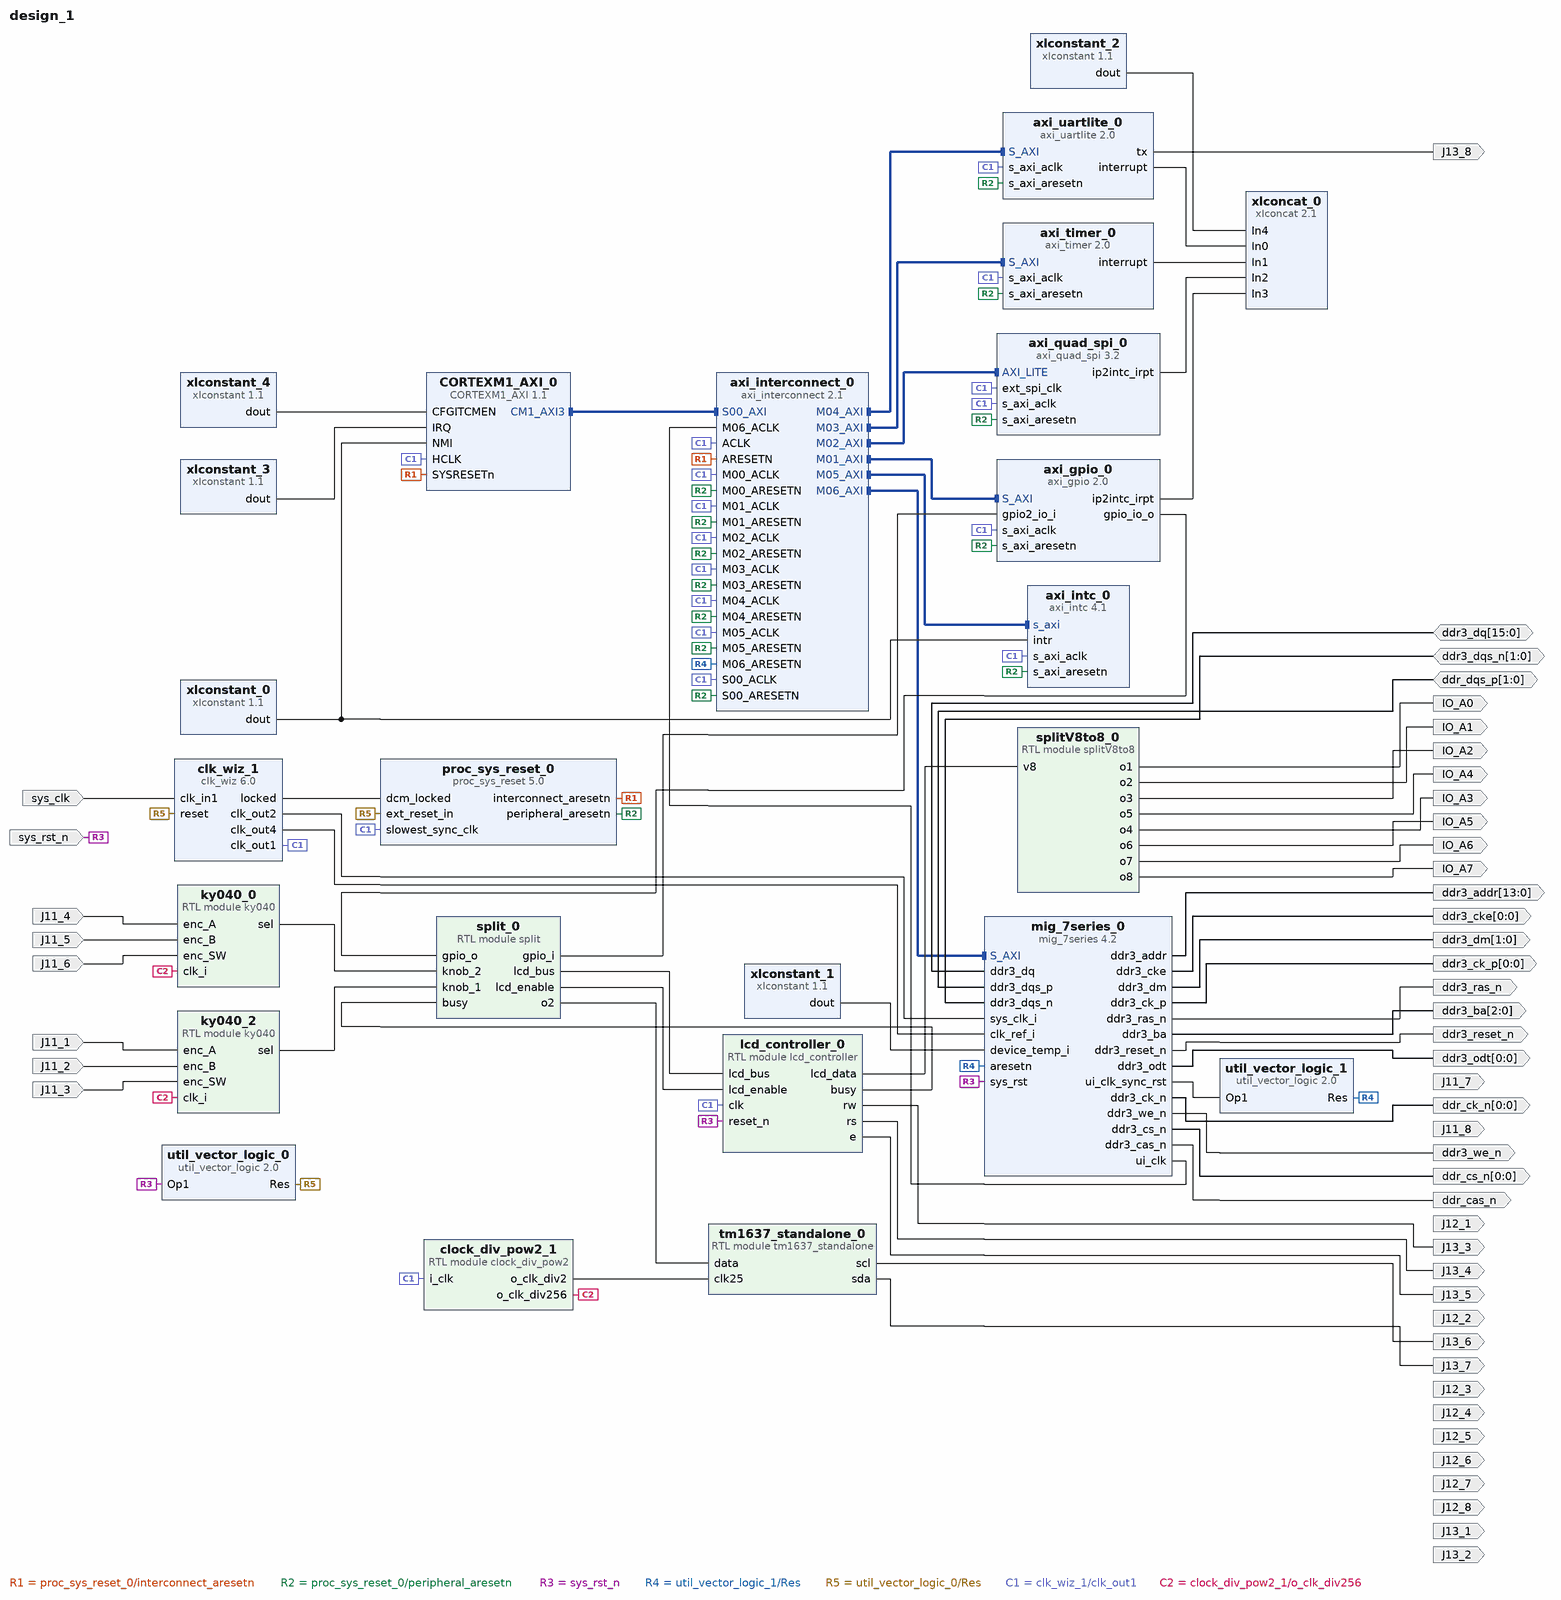
[diagram p0: block diagram of the top level]
# Vivado block design design_1, xc7k325tffg676-1, Vivado 2019.1
create_bd_design design_1

create_bd_port -dir I J11_1
create_bd_port -dir I J11_2
create_bd_port -dir I J11_3
create_bd_port -dir I J11_4
create_bd_port -dir I J11_5
create_bd_port -dir I J11_6
create_bd_port -dir O J11_7
create_bd_port -dir O J11_8
create_bd_port -dir O J12_1
create_bd_port -dir O J12_2
create_bd_port -dir O J12_3
create_bd_port -dir O J12_4
create_bd_port -dir O J12_5
create_bd_port -dir O J12_6
create_bd_port -dir O J12_7
create_bd_port -dir O J12_8
create_bd_port -dir O J13_1
create_bd_port -dir O J13_2
create_bd_port -dir O J13_3
create_bd_port -dir O J13_4
create_bd_port -dir O J13_5
create_bd_port -dir O J13_6
create_bd_port -dir O J13_7
create_bd_port -dir O J13_8
create_bd_port -dir O IO_A0
create_bd_port -dir O IO_A1
create_bd_port -dir O IO_A3
create_bd_port -dir O IO_A4
create_bd_port -dir O IO_A5
create_bd_port -dir O IO_A6
create_bd_port -dir O IO_A7
create_bd_port -dir O IO_A2
create_bd_port -dir I sys_clk
create_bd_port -dir I sys_rst_n
create_bd_port -dir O -from 13 -to 0 ddr3_addr
create_bd_port -dir IO -from 15 -to 0 ddr3_dq
create_bd_port -dir IO -from 1 -to 0 ddr_dqs_p
create_bd_port -dir IO -from 1 -to 0 ddr3_dqs_n
create_bd_port -dir O ddr3_ras_n
create_bd_port -dir O ddr3_we_n
create_bd_port -dir O ddr3_reset_n
create_bd_port -dir O -from 0 -to 0 ddr3_cke
create_bd_port -dir O -from 0 -to 0 ddr3_ck_p
create_bd_port -dir O -from 0 -to 0 ddr_ck_n
create_bd_port -dir O -from 1 -to 0 ddr3_dm
create_bd_port -dir O -from 0 -to 0 ddr_cs_n
create_bd_port -dir O -from 0 -to 0 ddr3_odt
create_bd_port -dir O ddr_cas_n
create_bd_port -dir O -from 2 -to 0 ddr3_ba

create_bd_cell -type ip -vlnv xilinx.com:ip:axi_quad_spi:3.2 axi_quad_spi_0
create_bd_cell -type ip -vlnv xilinx.com:ip:axi_timer:2.0 axi_timer_0
create_bd_cell -type ip -vlnv xilinx.com:ip:axi_uartlite:2.0 axi_uartlite_0
create_bd_cell -type ip -vlnv xilinx.com:ip:axi_gpio:2.0 axi_gpio_0
set_property -dict [list \
  CONFIG.C_ALL_INPUTS_2 1 \
  CONFIG.C_ALL_OUTPUTS 1 \
  CONFIG.C_INTERRUPT_PRESENT 1 \
  CONFIG.C_IS_DUAL 1 \
] [get_bd_cells axi_gpio_0]
create_bd_cell -type ip -vlnv xilinx.com:ip:axi_intc:4.1 axi_intc_0
create_bd_cell -type ip -vlnv xilinx.com:ip:axi_interconnect:2.1 axi_interconnect_0
set_property -dict {CONFIG.NUM_MI 7} [get_bd_cells axi_interconnect_0]
create_bd_cell -type ip -vlnv xilinx.com:ip:proc_sys_reset:5.0 proc_sys_reset_0
set_property -dict {CONFIG.C_AUX_RESET_HIGH 0} [get_bd_cells proc_sys_reset_0]
create_bd_cell -type ip -vlnv xilinx.com:ip:xlconstant:1.1 xlconstant_1
set_property -dict {CONFIG.CONST_VAL 0 CONFIG.CONST_WIDTH 12} [get_bd_cells xlconstant_1]
create_bd_cell -type ip -vlnv xilinx.com:ip:util_vector_logic:2.0 util_vector_logic_0
set_property -dict {CONFIG.C_OPERATION not} [get_bd_cells util_vector_logic_0]
create_bd_cell -type ip -vlnv xilinx.com:ip:xlconstant:1.1 xlconstant_2
set_property -dict {CONFIG.CONST_VAL 0 CONFIG.CONST_WIDTH 4} [get_bd_cells xlconstant_2]
create_bd_cell -type ip -vlnv xilinx.com:ip:xlconstant:1.1 xlconstant_3
set_property -dict {CONFIG.CONST_VAL 0 CONFIG.CONST_WIDTH 4} [get_bd_cells xlconstant_3]
create_bd_cell -type ip -vlnv xilinx.com:ip:xlconstant:1.1 xlconstant_4
set_property -dict {CONFIG.CONST_VAL 3 CONFIG.CONST_WIDTH 2} [get_bd_cells xlconstant_4]
create_bd_cell -type ip -vlnv xilinx.com:ip:xlconcat:2.1 xlconcat_0
set_property -dict {CONFIG.IN4_WIDTH 4 CONFIG.NUM_PORTS 5} [get_bd_cells xlconcat_0]
create_bd_cell -type ip -vlnv xilinx.com:ip:xlconstant:1.1 xlconstant_0
set_property -dict {CONFIG.CONST_VAL 0} [get_bd_cells xlconstant_0]
create_bd_cell -type ip -vlnv xilinx.com:ip:util_vector_logic:2.0 util_vector_logic_1
set_property -dict {CONFIG.C_OPERATION not CONFIG.C_SIZE 1} [get_bd_cells util_vector_logic_1]
create_bd_cell -type module -reference clock_div_pow2 clock_div_pow2_1
create_bd_cell -type ip -vlnv xilinx.com:ip:clk_wiz:6.0 clk_wiz_1
set_property -dict [list \
  CONFIG.CLKIN1_JITTER_PS 200.0 \
  CONFIG.CLKOUT1_JITTER 249.313 \
  CONFIG.CLKOUT1_PHASE_ERROR 155.997 \
  CONFIG.CLKOUT1_REQUESTED_OUT_FREQ 50.000 \
  CONFIG.CLKOUT2_JITTER 153.550 \
  CONFIG.CLKOUT2_PHASE_ERROR 155.997 \
  CONFIG.CLKOUT2_REQUESTED_OUT_FREQ 600.000 \
  CONFIG.CLKOUT2_USED true \
  CONFIG.CLKOUT3_JITTER 173.176 \
  CONFIG.CLKOUT3_PHASE_ERROR 155.997 \
  CONFIG.CLKOUT3_REQUESTED_OUT_FREQ 300.000 \
  CONFIG.CLKOUT3_USED true \
  CONFIG.CLKOUT4_JITTER 185.991 \
  CONFIG.CLKOUT4_PHASE_ERROR 155.997 \
  CONFIG.CLKOUT4_REQUESTED_OUT_FREQ 200.000 \
  CONFIG.CLKOUT4_USED true \
  CONFIG.CLKOUT5_JITTER 185.991 \
  CONFIG.CLKOUT5_PHASE_ERROR 155.997 \
  CONFIG.CLKOUT5_REQUESTED_OUT_FREQ 200.000 \
  CONFIG.CLKOUT5_USED true \
  CONFIG.MMCM_CLKFBOUT_MULT_F 12.000 \
  CONFIG.MMCM_CLKIN1_PERIOD 20.0 \
  CONFIG.MMCM_CLKIN2_PERIOD 10.0 \
  CONFIG.MMCM_CLKOUT0_DIVIDE_F 12.000 \
  CONFIG.MMCM_CLKOUT1_DIVIDE 1 \
  CONFIG.MMCM_CLKOUT2_DIVIDE 2 \
  CONFIG.MMCM_CLKOUT3_DIVIDE 3 \
  CONFIG.MMCM_CLKOUT4_DIVIDE 3 \
  CONFIG.NUM_OUT_CLKS 5 \
  CONFIG.PRIM_IN_FREQ 50.000 \
] [get_bd_cells clk_wiz_1]
create_bd_cell -type module -reference splitV8to8 splitV8to8_0
create_bd_cell -type module -reference split split_0
create_bd_cell -type module -reference tm1637_standalone tm1637_standalone_0
create_bd_cell -type module -reference lcd_controller lcd_controller_0
create_bd_cell -type ip -vlnv xilinx.com:ip:mig_7series:4.2 mig_7series_0
set_property -dict [list \
  CONFIG.BOARD_MIG_PARAM Custom \
  CONFIG.MIG_DONT_TOUCH_PARAM Custom \
  CONFIG.RESET_BOARD_INTERFACE Custom \
  CONFIG.XML_INPUT_FILE mig_a.prj \
] [get_bd_cells mig_7series_0]
create_bd_cell -type ip -vlnv arm.com:CortexM:CORTEXM1_AXI:1.1 CORTEXM1_AXI_0
set_property -dict {CONFIG.DEBUG_SEL 3} [get_bd_cells CORTEXM1_AXI_0]
create_bd_cell -type module -reference ky040 ky040_0
create_bd_cell -type module -reference ky040 ky040_2

# ---- connections ----

connect_bd_intf_net [get_bd_intf_pins axi_interconnect_0/M02_AXI] [get_bd_intf_pins axi_quad_spi_0/AXI_LITE]
connect_bd_intf_net [get_bd_intf_pins axi_interconnect_0/M01_AXI] [get_bd_intf_pins axi_gpio_0/S_AXI]
connect_bd_intf_net [get_bd_intf_pins CORTEXM1_AXI_0/CM1_AXI3] [get_bd_intf_pins axi_interconnect_0/S00_AXI]
connect_bd_intf_net [get_bd_intf_pins axi_interconnect_0/M03_AXI] [get_bd_intf_pins axi_timer_0/S_AXI]
connect_bd_intf_net [get_bd_intf_pins axi_interconnect_0/M04_AXI] [get_bd_intf_pins axi_uartlite_0/S_AXI]
connect_bd_intf_net [get_bd_intf_pins mig_7series_0/S_AXI] [get_bd_intf_pins axi_interconnect_0/M06_AXI]
connect_bd_intf_net [get_bd_intf_pins axi_interconnect_0/M05_AXI] [get_bd_intf_pins axi_intc_0/s_axi]
connect_bd_net [get_bd_pins axi_uartlite_0/tx] [get_bd_ports J13_8]
connect_bd_net [get_bd_pins axi_uartlite_0/interrupt] [get_bd_pins xlconcat_0/In0]
connect_bd_net [get_bd_pins axi_timer_0/interrupt] [get_bd_pins xlconcat_0/In1]
connect_bd_net [get_bd_pins axi_quad_spi_0/ip2intc_irpt] [get_bd_pins xlconcat_0/In2]
connect_bd_net [get_bd_pins axi_gpio_0/gpio_io_o] [get_bd_pins split_0/gpio_o]
connect_bd_net [get_bd_pins splitV8to8_0/o1] [get_bd_ports IO_A0]
connect_bd_net [get_bd_pins splitV8to8_0/o5] [get_bd_ports IO_A4]
connect_bd_net [get_bd_pins splitV8to8_0/o2] [get_bd_ports IO_A1]
connect_bd_net [get_bd_pins splitV8to8_0/o3] [get_bd_ports IO_A2]
connect_bd_net [get_bd_pins splitV8to8_0/o4] [get_bd_ports IO_A3]
connect_bd_net [get_bd_pins splitV8to8_0/o8] [get_bd_ports IO_A7]
connect_bd_net [get_bd_pins splitV8to8_0/o7] [get_bd_ports IO_A6]
connect_bd_net [get_bd_pins splitV8to8_0/o6] [get_bd_ports IO_A5]
connect_bd_net -net J11_1_1 [get_bd_ports J11_1] [get_bd_pins ky040_2/enc_A]
connect_bd_net -net J11_2_1 [get_bd_ports J11_2] [get_bd_pins ky040_2/enc_B]
connect_bd_net -net J11_3_1 [get_bd_ports J11_3] [get_bd_pins ky040_2/enc_SW]
connect_bd_net -net J11_4_1 [get_bd_ports J11_4] [get_bd_pins ky040_0/enc_A]
connect_bd_net -net J11_5_1 [get_bd_ports J11_5] [get_bd_pins ky040_0/enc_B]
connect_bd_net -net J11_6_1 [get_bd_ports J11_6] [get_bd_pins ky040_0/enc_SW]
connect_bd_net [get_bd_pins split_0/gpio_i] [get_bd_pins axi_gpio_0/gpio2_io_i]
connect_bd_net [get_bd_pins axi_gpio_0/ip2intc_irpt] [get_bd_pins xlconcat_0/In3]
connect_bd_net [get_bd_pins tm1637_standalone_0/scl] [get_bd_ports J13_6]
connect_bd_net [get_bd_pins tm1637_standalone_0/sda] [get_bd_ports J13_7]
connect_bd_net [get_bd_pins lcd_controller_0/e] [get_bd_ports J13_5]
connect_bd_net [get_bd_pins lcd_controller_0/rs] [get_bd_ports J13_4]
connect_bd_net [get_bd_pins lcd_controller_0/rw] [get_bd_ports J13_3]
connect_bd_net [get_bd_pins proc_sys_reset_0/interconnect_aresetn] [get_bd_pins axi_interconnect_0/ARESETN] [get_bd_pins CORTEXM1_AXI_0/SYSRESETn]
connect_bd_net [get_bd_pins proc_sys_reset_0/peripheral_aresetn] \
  [get_bd_pins axi_quad_spi_0/s_axi_aresetn] [get_bd_pins axi_timer_0/s_axi_aresetn] [get_bd_pins axi_gpio_0/s_axi_aresetn] \
  [get_bd_pins axi_uartlite_0/s_axi_aresetn] [get_bd_pins axi_intc_0/s_axi_aresetn] \
  [get_bd_pins axi_interconnect_0/S00_ARESETN] [get_bd_pins axi_interconnect_0/M00_ARESETN] \
  [get_bd_pins axi_interconnect_0/M01_ARESETN] [get_bd_pins axi_interconnect_0/M02_ARESETN] \
  [get_bd_pins axi_interconnect_0/M03_ARESETN] [get_bd_pins axi_interconnect_0/M04_ARESETN] \
  [get_bd_pins axi_interconnect_0/M05_ARESETN]
connect_bd_net [get_bd_pins xlconstant_0/dout] [get_bd_pins axi_intc_0/intr] [get_bd_pins CORTEXM1_AXI_0/NMI]
connect_bd_net [get_bd_pins xlconstant_2/dout] [get_bd_pins xlconcat_0/In4]
connect_bd_net [get_bd_ports sys_rst_n] \
  [get_bd_pins util_vector_logic_0/Op1] [get_bd_pins lcd_controller_0/reset_n] [get_bd_pins mig_7series_0/sys_rst]
connect_bd_net -net M06_ARESETN_1 [get_bd_pins util_vector_logic_1/Res] \
  [get_bd_pins axi_interconnect_0/M06_ARESETN] [get_bd_pins mig_7series_0/aresetn]
connect_bd_net -net clk_wiz_0_locked [get_bd_pins clk_wiz_1/locked] [get_bd_pins proc_sys_reset_0/dcm_locked]
connect_bd_net [get_bd_pins util_vector_logic_0/Res] [get_bd_pins clk_wiz_1/reset] [get_bd_pins proc_sys_reset_0/ext_reset_in]
connect_bd_net [get_bd_ports sys_clk] [get_bd_pins clk_wiz_1/clk_in1]
connect_bd_net [get_bd_pins clk_wiz_1/clk_out1] \
  [get_bd_pins clock_div_pow2_1/i_clk] [get_bd_pins axi_interconnect_0/ACLK] [get_bd_pins axi_interconnect_0/S00_ACLK] \
  [get_bd_pins axi_interconnect_0/M00_ACLK] [get_bd_pins axi_interconnect_0/M01_ACLK] \
  [get_bd_pins axi_interconnect_0/M02_ACLK] [get_bd_pins axi_interconnect_0/M03_ACLK] \
  [get_bd_pins axi_interconnect_0/M04_ACLK] [get_bd_pins axi_interconnect_0/M05_ACLK] [get_bd_pins axi_gpio_0/s_axi_aclk] \
  [get_bd_pins axi_quad_spi_0/ext_spi_clk] [get_bd_pins axi_quad_spi_0/s_axi_aclk] [get_bd_pins axi_timer_0/s_axi_aclk] \
  [get_bd_pins axi_uartlite_0/s_axi_aclk] [get_bd_pins axi_intc_0/s_axi_aclk] [get_bd_pins proc_sys_reset_0/slowest_sync_clk] \
  [get_bd_pins lcd_controller_0/clk] [get_bd_pins CORTEXM1_AXI_0/HCLK]
connect_bd_net [get_bd_pins clock_div_pow2_1/o_clk_div256] [get_bd_pins ky040_0/clk_i] [get_bd_pins ky040_2/clk_i]
connect_bd_net [get_bd_pins ky040_2/sel] [get_bd_pins split_0/knob_1]
connect_bd_net [get_bd_pins ky040_0/sel] [get_bd_pins split_0/knob_2]
connect_bd_net [get_bd_pins split_0/lcd_bus] [get_bd_pins lcd_controller_0/lcd_bus]
connect_bd_net [get_bd_pins split_0/lcd_enable] [get_bd_pins lcd_controller_0/lcd_enable]
connect_bd_net [get_bd_pins clock_div_pow2_1/o_clk_div2] [get_bd_pins tm1637_standalone_0/clk25]
connect_bd_net [get_bd_pins lcd_controller_0/lcd_data] [get_bd_pins splitV8to8_0/v8]
connect_bd_net [get_bd_pins lcd_controller_0/busy] [get_bd_pins split_0/busy]
connect_bd_net [get_bd_pins split_0/o2] [get_bd_pins tm1637_standalone_0/data]
connect_bd_net [get_bd_pins clk_wiz_1/clk_out2] [get_bd_pins mig_7series_0/sys_clk_i]
connect_bd_net [get_bd_pins clk_wiz_1/clk_out4] [get_bd_pins mig_7series_0/clk_ref_i]
connect_bd_net [get_bd_pins xlconstant_1/dout] [get_bd_pins mig_7series_0/device_temp_i]
connect_bd_net [get_bd_pins mig_7series_0/ui_clk] [get_bd_pins axi_interconnect_0/M06_ACLK]
connect_bd_net [get_bd_pins mig_7series_0/ui_clk_sync_rst] [get_bd_pins util_vector_logic_1/Op1]
connect_bd_net [get_bd_ports ddr3_dq] [get_bd_pins mig_7series_0/ddr3_dq]
connect_bd_net [get_bd_ports ddr_dqs_p] [get_bd_pins mig_7series_0/ddr3_dqs_p]
connect_bd_net [get_bd_ports ddr3_dqs_n] [get_bd_pins mig_7series_0/ddr3_dqs_n]
connect_bd_net [get_bd_pins mig_7series_0/ddr3_addr] [get_bd_ports ddr3_addr]
connect_bd_net [get_bd_pins mig_7series_0/ddr3_ras_n] [get_bd_ports ddr3_ras_n]
connect_bd_net [get_bd_pins mig_7series_0/ddr3_reset_n] [get_bd_ports ddr3_reset_n]
connect_bd_net [get_bd_pins mig_7series_0/ddr3_ck_n] [get_bd_ports ddr_ck_n]
connect_bd_net [get_bd_pins mig_7series_0/ddr3_cke] [get_bd_ports ddr3_cke]
connect_bd_net [get_bd_pins mig_7series_0/ddr3_dm] [get_bd_ports ddr3_dm]
connect_bd_net [get_bd_pins mig_7series_0/ddr3_odt] [get_bd_ports ddr3_odt]
connect_bd_net [get_bd_pins mig_7series_0/ddr3_cs_n] [get_bd_ports ddr_cs_n]
connect_bd_net [get_bd_pins mig_7series_0/ddr3_ck_p] [get_bd_ports ddr3_ck_p]
connect_bd_net [get_bd_pins mig_7series_0/ddr3_we_n] [get_bd_ports ddr3_we_n]
connect_bd_net [get_bd_pins mig_7series_0/ddr3_cas_n] [get_bd_ports ddr_cas_n]
connect_bd_net [get_bd_pins mig_7series_0/ddr3_ba] [get_bd_ports ddr3_ba]
connect_bd_net [get_bd_pins xlconstant_4/dout] [get_bd_pins CORTEXM1_AXI_0/CFGITCMEN]
connect_bd_net [get_bd_pins xlconstant_3/dout] [get_bd_pins CORTEXM1_AXI_0/IRQ]

# ---- address map ----
assign_bd_address -offset 0x40000000 -range 64K -target_address_space [get_bd_addr_spaces CORTEXM1_AXI_0/CM1_AXI3] [get_bd_addr_segs axi_gpio_0/S_AXI/Reg]
assign_bd_address -offset 0x40600000 -range 64K -target_address_space [get_bd_addr_spaces CORTEXM1_AXI_0/CM1_AXI3] [get_bd_addr_segs axi_uartlite_0/S_AXI/Reg]
assign_bd_address -offset 0x41200000 -range 64K -target_address_space [get_bd_addr_spaces CORTEXM1_AXI_0/CM1_AXI3] [get_bd_addr_segs axi_intc_0/S_AXI/Reg]
assign_bd_address -offset 0x41C00000 -range 64K -target_address_space [get_bd_addr_spaces CORTEXM1_AXI_0/CM1_AXI3] [get_bd_addr_segs axi_timer_0/S_AXI/Reg]
assign_bd_address -offset 0x44A00000 -range 64K -target_address_space [get_bd_addr_spaces CORTEXM1_AXI_0/CM1_AXI3] [get_bd_addr_segs axi_quad_spi_0/AXI_LITE/Reg]
assign_bd_address -offset 0x80000000 -range 256M -target_address_space [get_bd_addr_spaces CORTEXM1_AXI_0/CM1_AXI3] [get_bd_addr_segs mig_7series_0/memmap/memaddr]

validate_bd_design
save_bd_design
